# Altium project maix_2.PrjPcb
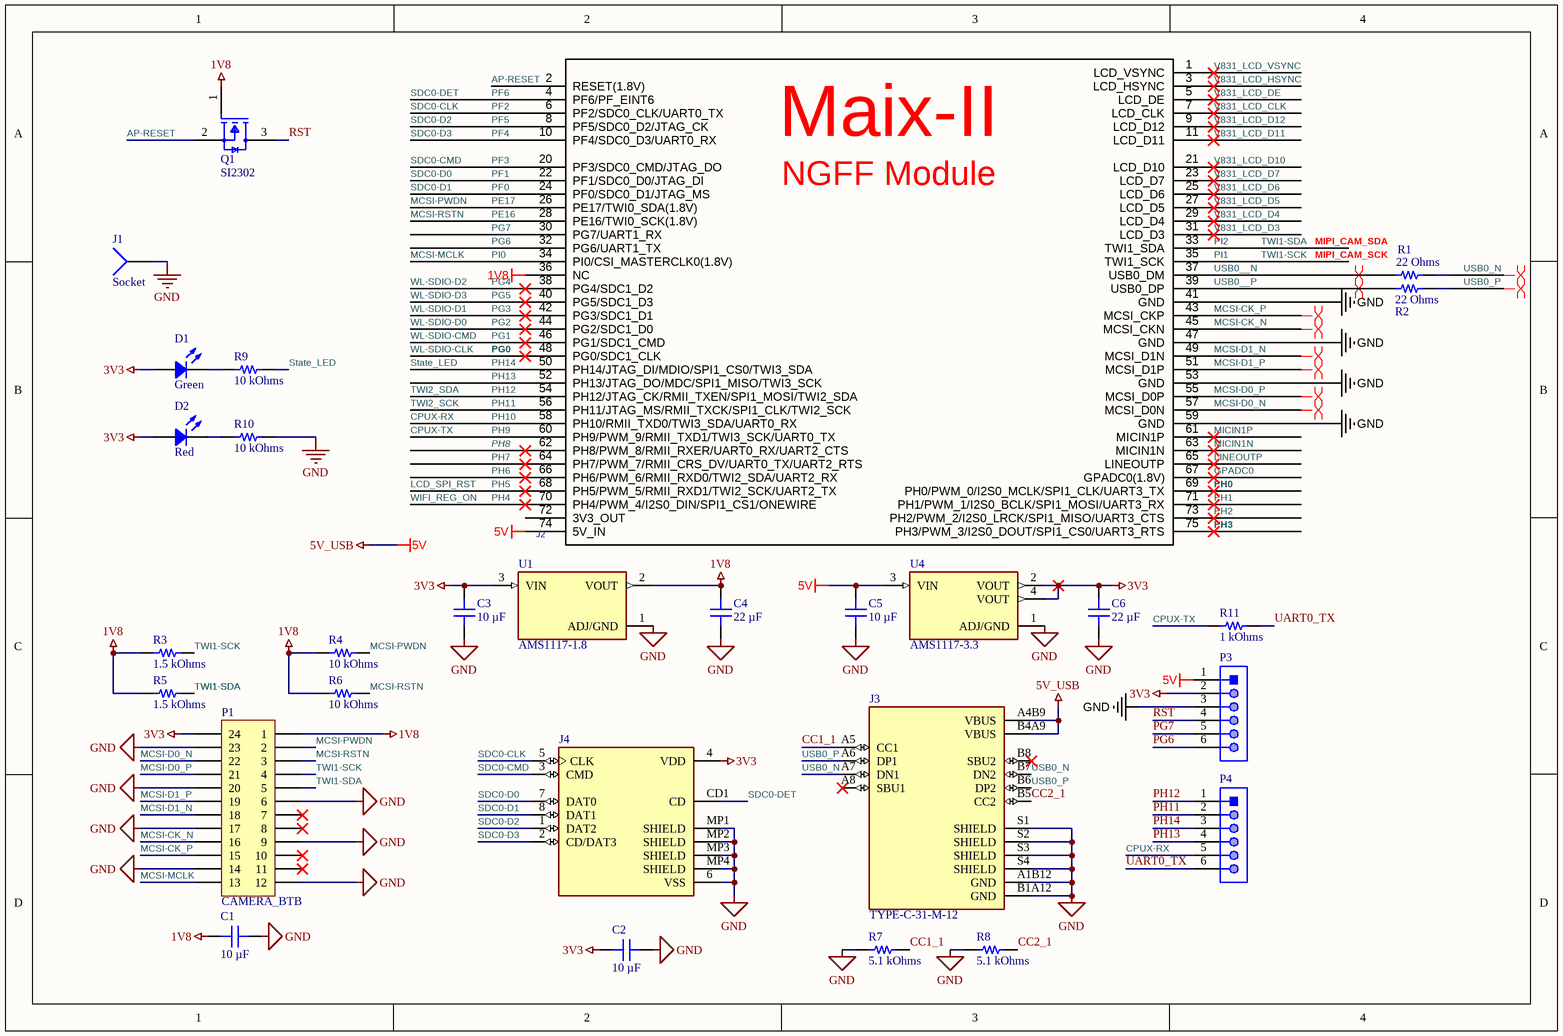
[diagram p0: Sheet1.SchDoc]
1 sheet, 29 parts. Net scope: global (net labels, ports and power ports of the same name join across sheets).
Board files: PCB2.PcbDoc, FPC.PcbDoc

## Sheet Sheet1.SchDoc
size A4; SheetNumber: 1; SheetTotal: 1

### Parts
C1  10 µF  [CAP 0402_1005]
C2  10 µF  [CAP 0402_1005]
C3  10 µF  [CAP 0402_1005]
C4  22 µF  [CAP_TAN_A1206]
C5  10 µF  [CAP 0402_1005]
C6  22 µF  [CAP_TAN_A1206]
D1  Green  [LED_0603_GREEN]
D2  Red  [LED_0603_RED]
J1  Socket  [M.2 SMT-FEMALE - FULL]
J2  NGFF-67P_B-KEY座子 4.2H高  [M2-67P0R50_B_FEMALE]  (value not drawn)  (no BOM)
J3  TYPE-C-31-M-12  [HRO_TYPE-C-31-M-12]
J4  TF-01A  [TF-01A]  (value not drawn)
P1  CAMERA_BTB  [F_24PIN]
P3  61300611121  [61300611121]  (value not drawn)
P4  61300611121  [61300611121]  (value not drawn)
Q1  SI2302  [FP-S-03946-IPC_B]
R1  22 Ohms  [RES 0402_1005]
R2  22 Ohms  [RES 0402_1005]
R3  1.5 kOhms  [RES 0402_1005]
R4  10 kOhms  [RES 0402_1005]
R5  1.5 kOhms  [RES 0402_1005]
R6  10 kOhms  [RES 0402_1005]
R7  5.1 kOhms  [RES 0402_1005]
R8  5.1 kOhms  [RES 0402_1005]
R9  10 kOhms  [RES 0402_1005]
R10  10 kOhms  [RES 0402_1005]
R11  1 kOhms  [RES 0402_1005]
U1  AMS1117-1.8  [SOT89-3]
U4  AMS1117-3.3  [SOT229P700X180-4N]

### Nets
1V8: C1.1 C4.1 J2.36(NC) P1.1 Q1.1(G) R3.1 R4.1 R5.1 R6.1 U1.2(VOUT)
3V3: C2.1 C3.1 C6.1 D1.1 D2.1 J4.4(VDD) P1.24 P3.2 U1.3(VIN) U4.2(VOUT) U4.4(VOUT)
5V: C5.1 J2.74(5V_IN) J3.A4B9(VBUS) J3.B4A9(VBUS) P3.1 U4.3(VIN)  [also labelled 5V_USB]
GND: C1.2 C2.2 C3.2 C4.2 C5.2 C6.2 J1.1 J2.41(GND) J2.47(GND) J2.53(GND) J2.59(GND) J3.A1B12(GND) J3.B1A12(GND) J3.S1(SHIELD) J3.S2(SHIELD) J3.S3(SHIELD) J3.S4(SHIELD) J4.6(VSS) J4.MP1(SHIELD) J4.MP2(SHIELD) J4.MP3(SHIELD) J4.MP4(SHIELD) P1.6 P1.9 P1.12 P1.14 P1.17 P1.20 P1.23 P3.3 R7.1 R8.1 R10.2 U1.1(ADJ/GND) U4.1(ADJ/GND)
AP-RESET: J2.2(RESET(1.8V)) Q1.2(S)
CC1_1: J3.A5(CC1) R7.2
CC2_1: J3.B5(CC2) R8.2
CPUX-RX: J2.58(PH10/RMII_TXD0/TWI3_SDA/UART0_RX) P4.5  [also labelled PH10]
CPUX-TX: J2.60(PH9/PWM_9/RMII_TXD1/TWI3_SCK/UART0_TX) R11.1  [also labelled PH9]
GPADC0: J2.67(GPADC0(1.8V))
LCD_SPI_RST: J2.68(PH5/PWM_5/RMII_RXD1/TWI2_SCK/UART2_TX)  [also labelled PH5]
LINEOUTP: J2.65(LINEOUTP)
MCSI-CK_N: J2.45(MCSI_CKN) P1.16
MCSI-CK_P: J2.43(MCSI_CKP) P1.15
MCSI-D0_N: J2.57(MCSI_D0N) P1.22
MCSI-D0_P: J2.55(MCSI_D0P) P1.21
MCSI-D1_N: J2.49(MCSI_D1N) P1.18
MCSI-D1_P: J2.51(MCSI_D1P) P1.19
MCSI-MCLK: J2.34(PI0/CSI_MASTERCLK0(1.8V)) P1.13  [also labelled PI0]
MCSI-PWDN: J2.26(PE17/TWI0_SDA(1.8V)) P1.2 R4.2  [also labelled PE17]
MCSI-RSTN: J2.28(PE16/TWI0_SCK(1.8V)) P1.3 R6.2  [also labelled PE16]
MICIN1N: J2.63(MICIN1N)
MICIN1P: J2.61(MICIN1P)
PF0: J2.24(PF0/SDC0_D1/JTAG_MS) J4.8(DAT1)  [also labelled SDC0-D1]
PF1: J2.22(PF1/SDC0_D0/JTAG_DI) J4.7(DAT0)  [also labelled SDC0-D0]
PF2: J2.6(PF2/SDC0_CLK/UART0_TX) J4.5(CLK)  [also labelled SDC0-CLK]
PF3: J2.20(PF3/SDC0_CMD/JTAG_DO) J4.3(CMD)  [also labelled SDC0-CMD]
PF4: J2.10(PF4/SDC0_D3/UART0_RX) J4.2(CD/DAT3)  [also labelled SDC0-D3]
PF5: J2.8(PF5/SDC0_D2/JTAG_CK) J4.1(DAT2)  [also labelled SDC0-D2]
PF6: J2.4(PF6/PF_EINT6) J4.CD1(CD)  [also labelled SDC0-DET]
PG0: J2.48(PG0/SDC1_CLK)  [also labelled WL-SDIO-CLK]
PG1: J2.46(PG1/SDC1_CMD)  [also labelled WL-SDIO-CMD]
PG2: J2.44(PG2/SDC1_D0)  [also labelled WL-SDIO-D0]
PG3: J2.42(PG3/SDC1_D1)  [also labelled WL-SDIO-D1]
PG4: J2.38(PG4/SDC1_D2)  [also labelled WL-SDIO-D2]
PG5: J2.40(PG5/SDC1_D3)  [also labelled WL-SDIO-D3]
PG6: J2.32(PG6/UART1_TX) P3.6
PG7: J2.30(PG7/UART1_RX) P3.5
PH0: J2.69(PH0/PWM_0/I2S0_MCLK/SPI1_CLK/UART3_TX)
PH1: J2.71(PH1/PWM_1/I2S0_BCLK/SPI1_MOSI/UART3_RX)
PH2: J2.73(PH2/PWM_2/I2S0_LRCK/SPI1_MISO/UART3_CTS)
PH3: J2.75(PH3/PWM_3/I2S0_DOUT/SPI1_CS0/UART3_RTS)
PH4: J2.70(PH4/PWM_4/I2S0_DIN/SPI1_CS1/ONEWIRE)  [also labelled WIFI_REG_ON]
PH6: J2.66(PH6/PWM_6/RMII_RXD0/TWI2_SDA/UART2_RX)
PH7: J2.64(PH7/PWM_7/RMII_CRS_DV/UART0_TX/UART2_RTS)
PH8: J2.62(PH8/PWM_8/RMII_RXER/UART0_RX/UART2_CTS)
PH11: J2.56(PH11/JTAG_MS/RMII_TXCK/SPI1_CLK/TWI2_SCK) P4.2  [also labelled TWI2_SCK]
PH12: J2.54(PH12/JTAG_CK/RMII_TXEN/SPI1_MOSI/TWI2_SDA) P4.1  [also labelled TWI2_SDA]
PH13: J2.52(PH13/JTAG_DO/MDC/SPI1_MISO/TWI3_SCK) P4.4
PH14: J2.50(PH14/JTAG_DI/MDIO/SPI1_CS0/TWI3_SDA) P4.3 R9.2  [also labelled State_LED]
PI1: J2.35(TWI1_SCK) P1.4 R3.2  [also labelled TWI1-SCK]
PI2: J2.33(TWI1_SDA) P1.5 R5.2  [also labelled TWI1-SDA]
RST: P3.4 Q1.3(D)
UART0_TX: P4.6 R11.2
USB0__N: J2.37(USB0_DM) R1.1
USB0__P: J2.39(USB0_DP) R2.1
USB0_N: J3.A7(DN1) J3.B7(DN2) R1.2
USB0_P: J3.A6(DP1) J3.B6(DP2) R2.2
V831_LCD_CLK: J2.7(LCD_CLK)
V831_LCD_D3: J2.31(LCD_D3)
V831_LCD_D4: J2.29(LCD_D4)
V831_LCD_D5: J2.27(LCD_D5)
V831_LCD_D6: J2.25(LCD_D6)
V831_LCD_D7: J2.23(LCD_D7)
V831_LCD_D10: J2.21(LCD_D10)
V831_LCD_D11: J2.11(LCD_D11)
V831_LCD_D12: J2.9(LCD_D12)
V831_LCD_DE: J2.5(LCD_DE)
V831_LCD_HSYNC: J2.3(LCD_HSYNC)
V831_LCD_VSYNC: J2.1(LCD_VSYNC)
NetD1_2: D1.2 R9.1
NetD2_2: D2.2 R10.1

Not connected (* = marked no-connect by the designer): J2 72(3V3_OUT); J3 A8(SBU1)* B8(SBU2)*; P1 7* 8* 10* 11*

### Layout directives
differential pair: MCSI-CK_N, MCSI-CK_P, MCSI-D0_N, MCSI-D0_P, MCSI-D1_N, MCSI-D1_P, USB0__N, USB0__P, USB0_N, USB0_P

### Notes on the sheet
- MIPI_CAM_SDA
- MIPI_CAM_SCK
- (in symbol NGFF-67P_B-MALE) Maix-II; NGFF Module

### Library data of the parts
C1-C3 C5 = GRM155R60E106ME16D: CAP CER 10UF 2.5V X5R 0402; manufacturer: Murata Electronics; Tolerance: ±20%; Part Number: GRM155R60E106ME16D; Value: 10 µF; Applications: General Purpose; Capacitance: 10 µF; componentlink1description: Datasheet; componentlink1url: https://search.murata.co.jp/Ceramy/image/img/A01X/G101/ENG/GRM155R60E106ME16-01.pdf; componentlink2description: DigiKey Link; componentlink2url: https://www.digikey.com/en/products/detail/murata-electronics/GRM155R60E106ME16D/4905100; Device Package: 0402 (1005 Metric); lastupdated: 2022/9/14 7:46:00; Lifecycle Status: Active; Minimum Order: 1; Mounting Type: Surface Mount, MLCC; Operating Temperature: -55°C ~ 85°C; Package / Case: 0402 (1005 Metric); packaging: TapeAndReel; partid: 6704; Part Status: Active; price: 0.02; series: GRM; Size / Dimension: 0.039" L x 0.020" W (1.00mm x 0.50mm); Supplier 1: DigiKey; Supplier Part Number 1: 490-10692-1-ND; Temperature Coefficient: X5R; Thickness (Max): 0.028" (0.70mm); Voltage - Rated: 2.5V
C4 C6 = GRM155R60E106ME16D: CAP CER 10UF 2.5V X5R 0402; manufacturer: Murata Electronics; Capacitance: 10 µF; Tolerance: ±20%; Part Number: GRM155R60E106ME16D; Value: 22 µF; Applications: General Purpose; componentlink1description: Datasheet; componentlink1url: https://search.murata.co.jp/Ceramy/image/img/A01X/G101/ENG/GRM155R60E106ME16-01.pdf; componentlink2description: DigiKey Link; componentlink2url: https://www.digikey.com/en/products/detail/murata-electronics/GRM155R60E106ME16D/4905100; Device Package: 0402 (1005 Metric); lastupdated: 2022/9/14 7:46:00; Lifecycle Status: Active; Minimum Order: 1; Mounting Type: Surface Mount, MLCC; Operating Temperature: -55°C ~ 85°C; Package / Case: 0402 (1005 Metric); packaging: TapeAndReel; partid: 6704; Part Status: Active; price: 0.02; series: GRM; Size / Dimension: 0.039" L x 0.020" W (1.00mm x 0.50mm); Supplier 1: DigiKey; Supplier Part Number 1: 490-10692-1-ND; Temperature Coefficient: X5R; Thickness (Max): 0.028" (0.70mm); Voltage - Rated: 2.5V
D1 = EAST10052GA0: LED GREEN CLEAR 2SMD; Manufacturer: Everlight Electronics Co Ltd; Configuration: Standard; Current - Test: 5mA; Lens Color: Colorless; Lens Size: 1.00mm x 0.50mm; Lens Style: Rectangle with Flat Top; Viewing Angle: 120°; Voltage - Forward (Vf) (Typ): 2.95V; Wavelength - Peak: 518nm; Part Number: EAST10052GA0; Color: Green; ComponentLink1Description: Datasheet; ComponentLink1URL: https://everlightamericas.com/index.php?controller=attachment&id_attachment=3256; ComponentLink2Description: DigiKey Link; ComponentLink2URL: https://www.digikey.com/en/products/detail/everlight-electronics-co-ltd/EAST10052GA0/8510366; Device Package: 0402 (1005 Metric); Height (Max): 0.25mm; LastUpdated: 2022/9/14 8:36:15; Lens Transparency: Clear; Lifecycle Status: Active; Minimum Order: 1; Mounting Type: Surface Mount; Package / Case: 0402 (1005 Metric); Packaging: TapeAndReel; PartId: 696; Part Status: Active; Price: 0.06; Series: -; Size / Dimension: 1.00mm L x 0.50mm W; Supplier 1: DigiKey; Supplier Part Number 1: 1080-1557-1-ND; Supplier Device Package: 2-SMD; Value: Green
D2 = QBLP595-R-2897: 0402 LED RED, CLEAR LENS, 330MCD; Manufacturer: QT Brightek (QTB); Configuration: Standard; Current - Test: 20mA; Lens Color: Colorless; Lens Size: 0.70mm x 0.50mm; Lens Style: Rectangle with Flat Top; Viewing Angle: 120°; Voltage - Forward (Vf) (Typ): 2.1V; Wavelength - Dominant: 620nm; Part Number: QBLP595-R-2897; Color: Red; ComponentLink1Description: Datasheet; ComponentLink1URL: https://www.qt-brightek.com/datasheet/QBLP595-R-2897.pdf; ComponentLink2Description: DigiKey Link; ComponentLink2URL: https://www.digikey.com/en/products/detail/qt-brightek-qtb/QBLP595-R-2897/16499677; Device Package: 0402 (1005 Metric); Height (Max): 0.60mm; LastUpdated: 2022/9/14 8:36:36; Lens Transparency: Clear; Lifecycle Status: Active; Millicandela Rating: 330mcd; Minimum Order: 1; Mounting Type: Surface Mount; Package / Case: 0402 (1005 Metric); Packaging: TapeAndReel; PartId: 1086; Part Status: Active; Price: 0.07; Series: QBLP595; Size / Dimension: 1.00mm L x 0.50mm W; Supplier 1: DigiKey; Supplier Part Number 1: 1516-QBLP595-R-2897CT-ND; Supplier Device Package: 0402; Value: Red
J2 = NGFF-67P_B-MALE
J3 = TYPE-C-31-M-12: USB Connectors 24 Receptacle 1 8.94*7.3mm RoHS; MF: {'manufacturer': u'HRO Electronics Co., Ltd.'}; MP: TYPE-C-31-M-12; Availability: Unavailable; Price: None; Value: *; Package: None
J4 = TF-01A: <b>Connector - Card Sockets 8 1.1mm SMD RoHS</b><p> Source: <a href="https://datasheet.lcsc.com/szlcsc/1903221101_Korean-Hroparts-Elec-TF-01A_C91145.pdf"> Datasheet </a>; MF: {'manufacturer': u'HRO Electronics Co., Ltd.'}; Availability: Unavailable; MP: TF-01A; Price: None; Package: None; Value: *
P1 = Header 12X2A: Header, 12-Pin, Dual row; LatestRevisionDate: 17-Jul-2002; LatestRevisionNote: Re-released for DXP Platform.; Publisher: Altium Limited
P3 P4 = CMP-1502-01070-1: THT Vertical Pin Header WR-PHD, Pitch 2.54 mm, Single Row, 6 pins; Manufacturer: Wurth Elektronik; Gender: Male; Pin Number: 6; Pitch: 2.54mm; Working Voltage: 250VAC; Rated Current: 3A; Withstanding Voltage: 500VAC; Contact Resistance: 20mOhm; Operating Temperature: -40to105degC; Packaging: Bag; Datasheet URL: https://katalog.we-online.de/em/datasheet/6130xx11121.pdf; Package Reference: 61300611121; Mounting Technology: THT; Publisher: WurthElektronik; Part Number: 61300611121; Manufacturer URL: http://www.we-online.de; Row Number: Single; Orientation: Vertical
Q1 = CMP-02550-000243-1: MOSFET N-CH 20V 2.9A SOT23-3; Max Power Dissipation: 710mW; Number of Channels: 1; Turn-On Delay Time: 8ns; Rise Time: 7ns; Continuous Drain Current (ID): 2.6A; Drain to Source Resistance: 57mR; Gate to Source Voltage (Vgs): 8V; Turn-Off Delay Time: 30ns; RoHS Compliant: Yes; Drain to Source Voltage (Vdss): 20V; Case/Package: SOT-23; Lead Free: Lead Free; Weight: 0.050717oz; REACH SVHC: No SVHC; Max Operating Temperature: 150°C; Number of Elements: 1; Fall Time: 7ns; Packaging: Tape and Reel; Package Quantity: 3000; Number of Pins: 3; Power Dissipation: 710mW; Mount: Surface Mount; Min Operating Temperature: -55°C
R1 R2 = SR0402FR-7W22RL: RES 22 OHM 1% 1/8W 0402; Manufacturer: Yageo; Power (Watts): 0.125W, 1/8W; Temperature Coefficient: ±100ppm/°C; Part Number: SR0402FR-7W22RL; Value: 22 Ohms; ComponentLink1Description: Datasheet; ComponentLink1URL: http://www.yageo.com/documents/recent/PYu-SR_D_F%20tol_RoHS_L_4.pdf; ComponentLink2Description: DigiKey Link; ComponentLink2URL: https://www.digikey.com/en/products/detail/yageo/SR0402FR-7W22RL/9373094; Composition: Thick Film; Device Package: 0402 (1005 Metric); Features: Automotive AEC-Q200, Pulse Withstanding; Height - Seated (Max): 0.016" (0.40mm); LastUpdated: 2022/9/14 8:02:27; Lifecycle Status: Active; Minimum Order: 1; Number of Terminations: 2; Operating Temperature: -55°C ~ 155°C; Package / Case: 0402 (1005 Metric); Packaging: TapeAndReel; PartId: 4390; Part Status: Active; Price: 0.07; Ratings: AEC-Q200; Resistance: 22 Ohms; Series: SR; Size / Dimension: 0.039" L x 0.020" W (1.00mm x 0.50mm); Supplier 1: DigiKey; Supplier Part Number 1: YAG5820CT-ND; Supplier Device Package: 0402; Tolerance: ±1%
R3 R5 = PTN0402Y1501BST1: PTN0402 10PPM 1.5K 0.1% S T1 E1; Manufacturer: Vishay Dale Thin Film; Power (Watts): 0.05W, 1/20W; Temperature Coefficient: ±10ppm/°C; Part Number: PTN0402Y1501BST1; Value: 1.5 kOhms; ComponentLink1Description: Datasheet; ComponentLink1URL: https://www.vishay.com/docs/60026/ptn.pdf; ComponentLink2Description: DigiKey Link; ComponentLink2URL: https://www.digikey.com/en/products/detail/vishay-dale-thin-film/PTN0402Y1501BST1/12820654; Composition: Thin Film; Device Package: 0402 (1005 Metric); Features: Anti-Sulfur, Moisture Resistant, Non-Inductive; Height - Seated (Max): 0.033" (0.84mm); LastUpdated: 2022/9/14 8:01:19; Lifecycle Status: Active; Minimum Order: 1; Number of Terminations: 2; Operating Temperature: -55°C ~ 155°C; Package / Case: 0402 (1005 Metric); Packaging: TapeAndReel; PartId: 59552; Part Status: Active; Price: 0.27; Resistance: 1.5 kOhms; Series: PTN; Size / Dimension: 0.042" L x 0.022" W (1.07mm x 0.56mm); Supplier 1: DigiKey; Supplier Part Number 1: 764-PTN0402Y1501BST1CT-ND; Supplier Device Package: 0402; Tolerance: ±0.1%
R4 R6 = P2TC0402D1002LNTA: P2TC0402 2PPM/C 10K 0,01% N TA; Manufacturer: Vishay Sfernice; Power (Watts): 0.063W, 1/16W; Temperature Coefficient: ±2ppm/°C; Tolerance: ±0.01%; Part Number: P2TC0402D1002LNTA; Value: 10 kOhms; ComponentLink1Description: Datasheet; ComponentLink1URL: https://www.vishay.com/docs/53080/p2tc.pdf; ComponentLink2Description: DigiKey Link; ComponentLink2URL: https://www.digikey.com/en/products/detail/vishay-sfernice/P2TC0402D1002LNTA/11657715; Composition: Thin Film; Device Package: 0402 (1005 Metric); Features: Anti-Sulfur, Moisture Resistant; Height - Seated (Max): 0.025" (0.63mm); LastUpdated: 2022/9/14 8:01:18; Lifecycle Status: Active; Minimum Order: 1; Number of Terminations: 2; Operating Temperature: -55°C ~ 155°C; Package / Case: 0402 (1005 Metric); Packaging: TapeAndReel; PartId: 59061; Part Status: Active; Price: 13.14; Resistance: 10 kOhms; Series: P2TC; Size / Dimension: 0.039" L x 0.024" W (1.00mm x 0.60mm); Supplier 1: DigiKey; Supplier Part Number 1: 716-P2TC0402D1002LNTACT-ND; Supplier Device Package: 0402
R7 R8 = RN73R1ETTP5101B25: RES 5.1K OHM 0.1% 1/16W 0402; Manufacturer: KOA Speer Electronics, Inc.; Power (Watts): 0.063W, 1/16W; Temperature Coefficient: ±25ppm/°C; Part Number: RN73R1ETTP5101B25; Value: 5.1 kOhms; ComponentLink1Description: Datasheet; ComponentLink1URL: //media.digikey.com/pdf/Data%20Sheets/KOA%20Speer/RN73R_Type_DS.pdf; ComponentLink2Description: DigiKey Link; ComponentLink2URL: https://www.digikey.com/en/products/detail/koa-speer-electronics-inc/RN73R1ETTP5101B25/9991854; Composition: Thin Film; Device Package: 0402 (1005 Metric); Features: Automotive AEC-Q200, Moisture Resistant; Height - Seated (Max): 0.016" (0.40mm); LastUpdated: 2022/9/14 8:02:23; Lifecycle Status: Active; Minimum Order: 1; Number of Terminations: 2; Operating Temperature: -55°C ~ 155°C; Package / Case: 0402 (1005 Metric); Packaging: TapeAndReel; PartId: 5343; Part Status: Active; Price: 0.06; Ratings: AEC-Q200; Resistance: 5.1 kOhms; Series: RN73R; Size / Dimension: 0.039" L x 0.020" W (1.00mm x 0.50mm); Supplier 1: DigiKey; Supplier Part Number 1: 2019-RN73R1ETTP5101B25CT-ND; Supplier Device Package: 0402; Tolerance: ±0.1%
R9 R10 = RP73PF1E10KBTD: RES 10K OHM 0.1% 1/10W 0402; Manufacturer: TE Connectivity Passive Product; Power (Watts): 0.1W, 1/10W; Temperature Coefficient: ±25ppm/°C; Part Number: RP73PF1E10KBTD; Value: 10 kOhms; ComponentLink1Description: Datasheet; ComponentLink1URL: https://www.te.com/commerce/DocumentDelivery/DDEController?Action=srchrtrv&DocNm=1773272&DocType=DS&DocLang=English; ComponentLink2Description: DigiKey Link; ComponentLink2URL: https://www.digikey.com/en/products/detail/te-connectivity-passive-product/RP73PF1E10KBTD/8260957; Composition: Thin Film; Device Package: 0402 (1005 Metric); Height - Seated (Max): 0.014" (0.35mm); LastUpdated: 2022/9/14 8:02:33; Lifecycle Status: Active; Minimum Order: 1; Number of Terminations: 2; Operating Temperature: -55°C ~ 155°C; Package / Case: 0402 (1005 Metric); Packaging: TapeAndReel; PartId: 2434; Part Status: Active; Price: 0.09; Resistance: 10 kOhms; Series: RP73, Holsworthy; Size / Dimension: 0.039" L x 0.020" W (1.00mm x 0.50mm); Supplier 1: DigiKey; Supplier Part Number 1: A127415CT-ND; Supplier Device Package: 0402; Tolerance: ±0.1%
R11 = RNCF0402TKY1K00: RES 1K OHM 0.01% 1/16W 0402; Manufacturer: Stackpole Electronics Inc; Power (Watts): 0.063W, 1/16W; Temperature Coefficient: ±5ppm/°C; Part Number: RNCF0402TKY1K00; Value: 1 kOhms; ComponentLink1Description: Datasheet; ComponentLink1URL: https://www.seielect.com/catalog/sei-rncf.pdf; ComponentLink2Description: DigiKey Link; ComponentLink2URL: https://www.digikey.com/en/products/detail/stackpole-electronics-inc/RNCF0402TKY1K00/5432231; Composition: Thin Film; Device Package: 0402 (1005 Metric); Features: Automotive AEC-Q200; Height - Seated (Max): 0.014" (0.35mm); LastUpdated: 2022/9/14 8:01:36; Lifecycle Status: Active; Minimum Order: 1; Number of Terminations: 2; Operating Temperature: -55°C ~ 155°C; Package / Case: 0402 (1005 Metric); Packaging: TapeAndReel; PartId: 20099; Part Status: Active; Price: 0.88; Ratings: AEC-Q200; Resistance: 1 kOhms; Series: RNCF; Size / Dimension: 0.039" L x 0.020" W (1.00mm x 0.50mm); Supplier 1: DigiKey; Supplier Part Number 1: RNCF0402TKY1K00CT-ND; Supplier Device Package: 0402; Tolerance: ±0.01%
U1 U4 = AMS1117: Sot223/Pkg 1-Amp 5-Volt Low Drop Out Voltage Regulatator; MF: {'manufacturer': u'Advanced Monolithic Systems'}; Availability: Unavailable; Price: None; Value: *; MP: AMS1117; Package: None
J1 = Socket: LatestRevisionDate: 17-Jul-2002; LatestRevisionNote: Re-released for DXP Platform.; Publisher: Altium Limited